# Altium schematic sheet ADC-ADC.SchDoc: <SPECIFIC SHEET FUNCTION>
size A3; Date: DO NOT USE, RATHER USE PROJ OPTIONS; DrawnBy: DO NOT USE, RATHER USE PROJ OPTIONS; Engineer: DO NOT USE, RATHER USE PROJ OPTIONS; Organization: DO NOT USE, RATHER USE PROJ OPTIONS; DocumentNumber: 10; Revision: DO NOT USE, RATHER USE PROJ OPTIONS; SheetNumber: 10; SheetTotal: 12; SCH_Sheet_Filename: ADC-ADC.SchDoc; CurrentTime: DO NOT USE, RATHER USE PROJ OPTIONS; Time: DO NOT USE, RATHER USE PROJ OPTIONS; DocumentFullPathAndName: DO NOT USE, RATHER USE PROJ OPTIONS; DocumentName: DO NOT USE, RATHER USE PROJ OPTIONS; ModifiedDate: DO NOT USE, RATHER USE PROJ OPTIONS; ImagePath: DO NOT USE, RATHER USE PROJ OPTIONS
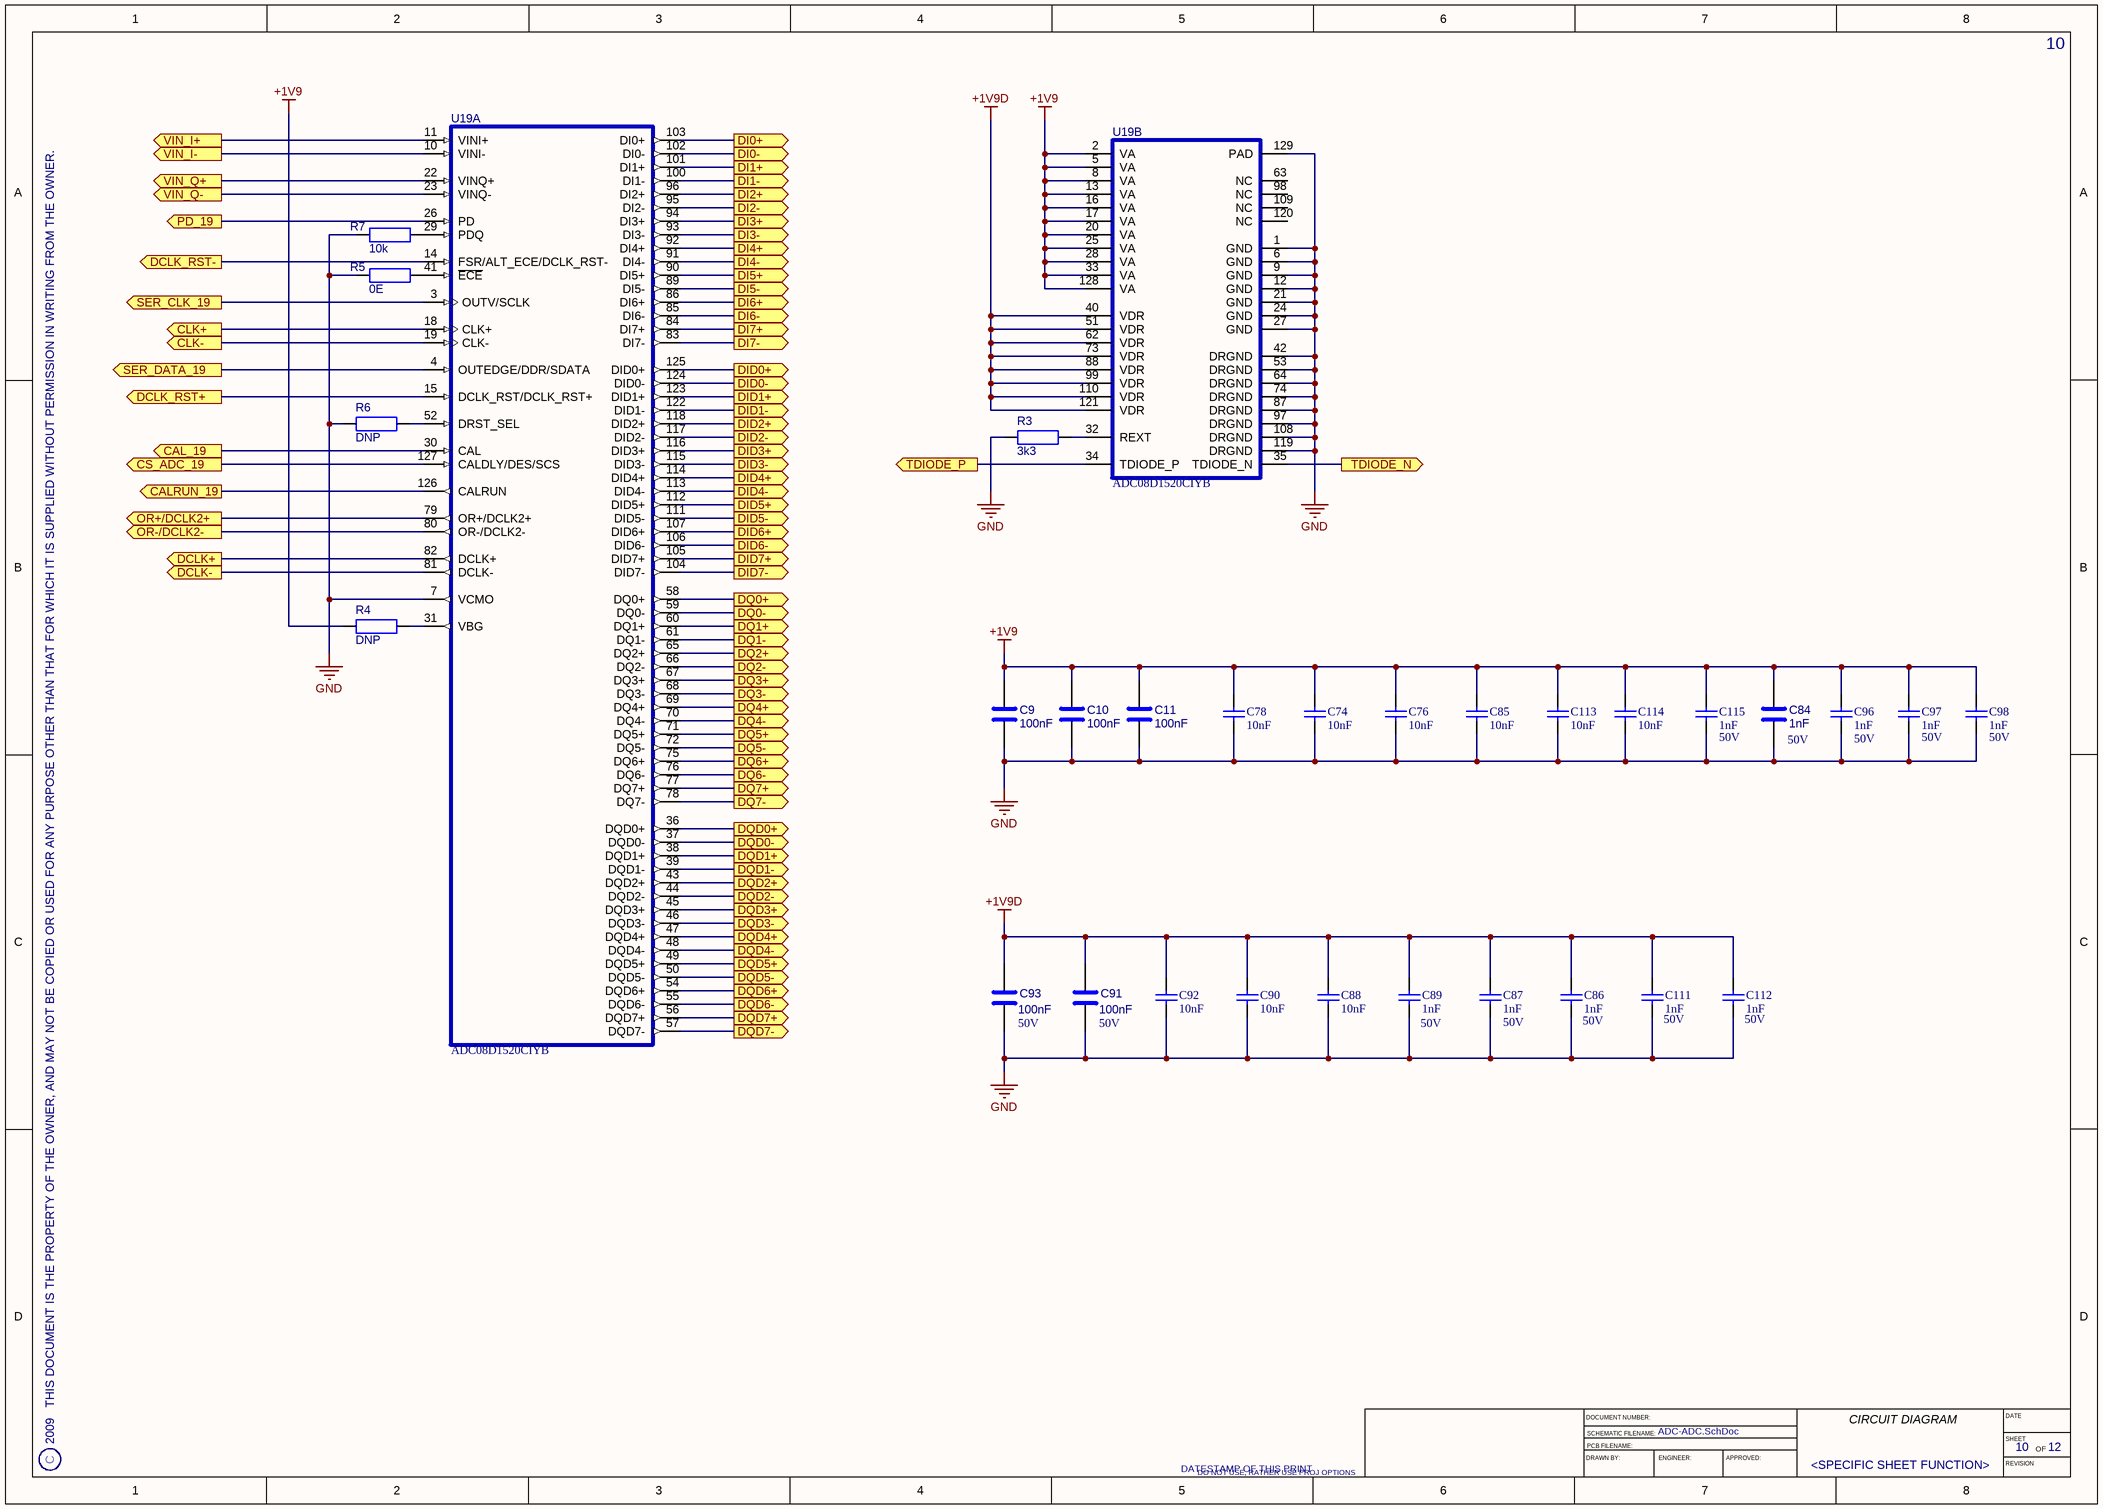
[diagram p0: ADC-ADC.SchDoc]

## Parts
C9  100nF  [0603]
C10  100nF  [0603]
C11  100nF  [0603]
C74  value 10nF  [CAPC1005X55N]  (hidden comment: Capacitor 0402 SMD)
C76  value 10nF  [CAPC1005X55N]  (hidden comment: Capacitor 0402 SMD)
C78  value 10nF  [CAPC1005X55N]  (hidden comment: Capacitor 0402 SMD)
C84  value 1nF  Voltage: 50V  [CAPC1005X55N]  (hidden comment: *)
C85  value 10nF  [CAPC1005X55N]  (hidden comment: Capacitor 0402 SMD)
C86  value 1nF  Voltage: 50V  [CAPC1005X55N]  (hidden comment: Capacitor 0402 SMD)
C87  value 1nF  Voltage: 50V  [CAPC1005X55N]  (hidden comment: Capacitor 0402 SMD)
C88  value 10nF  [CAPC1005X55N]  (hidden comment: Capacitor 0402 SMD)
C89  value 1nF  Voltage: 50V  [CAPC1005X55N]  (hidden comment: Capacitor 0402 SMD)
C90  value 10nF  [CAPC1005X55N]  (hidden comment: Capacitor 0402 SMD)
C91  value 100nF  Voltage: 50V  [0603]  (hidden comment: *)
C92  value 10nF  [CAPC1005X55N]  (hidden comment: Capacitor 0402 SMD)
C93  value 100nF  Voltage: 50V  [0603]  (hidden comment: *)
C96  value 1nF  Voltage: 50V  [CAPC1005X55N]  (hidden comment: Capacitor 0402 SMD)
C97  value 1nF  Voltage: 50V  [CAPC1005X55N]  (hidden comment: Capacitor 0402 SMD)
C98  value 1nF  Voltage: 50V  [CAPC1005X55N]  (hidden comment: Capacitor 0402 SMD)
C111  value 1nF  Voltage: 50V  [CAPC1005X55N]  (hidden comment: Capacitor 0402 SMD)
C112  value 1nF  Voltage: 50V  [CAPC1005X55N]  (hidden comment: Capacitor 0402 SMD)
C113  value 10nF  [CAPC1005X55N]  (hidden comment: Capacitor 0402 SMD)
C114  value 10nF  [CAPC1005X55N]  (hidden comment: Capacitor 0402 SMD)
C115  value 1nF  Voltage: 50V  [CAPC1005X55N]  (hidden comment: Capacitor 0402 SMD)
R3  3k3  [RESC1005X40N]
R4  DNP  [RESC1005X40N]
R5  0E  [RESC1005X40N]
R6  DNP  [RESC1005X40N]
R7  10k  [RESC1005X40N]
U19  ADC08D1520CIYB  [NS_VNX128A]  (parts A,B of 2)

## Ports
CAL_19 (out), CALRUN_19 (out), CLK+ (out), CLK- (out), CS_ADC_19 (out), DCLK+ (out), DCLK- (out), DCLK_RST+ (out), DCLK_RST- (out), DI0+ (out), DI0- (out), DI1+ (out), DI1- (out), DI2+ (out), DI2- (out), DI3+ (out), DI3- (out), DI4+ (out), DI4- (out), DI5+ (out), DI5- (out), DI6+ (out), DI6- (out), DI7+ (out), DI7- (out), DID0+ (out), DID0- (out), DID1+ (out), DID1- (out), DID2+ (out), DID2- (out), DID3+ (out), DID3- (out), DID4+ (out), DID4- (out), DID5+ (out), DID5- (out), DID6+ (out), DID6- (out), DID7+ (out), DID7- (out), DQ0+ (out), DQ0- (out), DQ1+ (out), DQ1- (out), DQ2+ (out), DQ2- (out), DQ3+ (out), DQ3- (out), DQ4+ (out), DQ4- (out), DQ5+ (out), DQ5- (out), DQ6+ (out), DQ6- (out), DQ7+ (out), DQ7- (out), DQD0+ (out), DQD0- (out), DQD1+ (out), DQD1- (out), DQD2+ (out), DQD2- (out), DQD3+ (out), DQD3- (out), DQD4+ (out), DQD4- (out), DQD5+ (out), DQD5- (out), DQD6+ (out), DQD6- (out), DQD7+ (out), DQD7- (out), OR+/DCLK2+ (out), OR-/DCLK2- (out), PD_19 (out), SER_CLK_19 (out), SER_DATA_19 (out), TDIODE_N (out), TDIODE_P (out), VIN_I+ (out), VIN_I- (out), VIN_Q+ (out), VIN_Q- (out)

## Nets
+1V9: C9.2 C10.2 C11.2 C74.1 C76.1 C78.1 C84.1 C85.1 C96.1 C97.1 C98.1 C113.1 C114.1 C115.1 R4.1 U19.2(VA) U19.5(VA) U19.8(VA) U19.13(VA) U19.16(VA) U19.17(VA) U19.20(VA) U19.25(VA) U19.28(VA) U19.33(VA) U19.128(VA)
+1V9D: C86.1 C87.1 C88.1 C89.1 C90.1 C91.1 C92.1 C93.1 C111.1 C112.1 U19.40(VDR) U19.51(VDR) U19.62(VDR) U19.73(VDR) U19.88(VDR) U19.99(VDR) U19.110(VDR) U19.121(VDR)
GND: C9.1 C10.1 C11.1 C74.2 C76.2 C78.2 C84.2 C85.2 C86.2 C87.2 C88.2 C89.2 C90.2 C91.2 C92.2 C93.2 C96.2 C97.2 C98.2 C111.2 C112.2 C113.2 C114.2 C115.2 R3.1 R5.1 R6.1 R7.1 U19.1(GND) U19.6(GND) U19.7(VCMO) U19.9(GND) U19.12(GND) U19.21(GND) U19.24(GND) U19.27(GND) U19.42(DRGND) U19.53(DRGND) U19.64(DRGND) U19.74(DRGND) U19.87(DRGND) U19.97(DRGND) U19.108(DRGND) U19.119(DRGND) U19.129(PAD)
CAL_19: U19.30(CAL) ; port CAL_19
CALRUN_19: U19.126(CALRUN) ; port CALRUN_19
CLK+: U19.18(CLK+) ; port CLK+
CLK-: U19.19(CLK-) ; port CLK-
CS_ADC_19: U19.127(CALDLY/DES/SCS) ; port CS_ADC_19
DCLK+: U19.82(DCLK+) ; port DCLK+
DCLK-: U19.81(DCLK-) ; port DCLK-
DCLK_RST+: U19.15(DCLK_RST/DCLK_RST+) ; port DCLK_RST+
DCLK_RST-: U19.14(FSR/ALT_ECE/DCLK_RST-) ; port DCLK_RST-
DI0+: U19.103(DI0+) ; port DI0+
DI0-: U19.102(DI0-) ; port DI0-
DI1+: U19.101(DI1+) ; port DI1+
DI1-: U19.100(DI1-) ; port DI1-
DI2+: U19.96(DI2+) ; port DI2+
DI2-: U19.95(DI2-) ; port DI2-
DI3+: U19.94(DI3+) ; port DI3+
DI3-: U19.93(DI3-) ; port DI3-
DI4+: U19.92(DI4+) ; port DI4+
DI4-: U19.91(DI4-) ; port DI4-
DI5+: U19.90(DI5+) ; port DI5+
DI5-: U19.89(DI5-) ; port DI5-
DI6+: U19.86(DI6+) ; port DI6+
DI6-: U19.85(DI6-) ; port DI6-
DI7+: U19.84(DI7+) ; port DI7+
DI7-: U19.83(DI7-) ; port DI7-
DID0+: U19.125(DID0+) ; port DID0+
DID0-: U19.124(DID0-) ; port DID0-
DID1+: U19.123(DID1+) ; port DID1+
DID1-: U19.122(DID1-) ; port DID1-
DID2+: U19.118(DID2+) ; port DID2+
DID2-: U19.117(DID2-) ; port DID2-
DID3+: U19.116(DID3+) ; port DID3+
DID3-: U19.115(DID3-) ; port DID3-
DID4+: U19.114(DID4+) ; port DID4+
DID4-: U19.113(DID4-) ; port DID4-
DID5+: U19.112(DID5+) ; port DID5+
DID5-: U19.111(DID5-) ; port DID5-
DID6+: U19.107(DID6+) ; port DID6+
DID6-: U19.106(DID6-) ; port DID6-
DID7+: U19.105(DID7+) ; port DID7+
DID7-: U19.104(DID7-) ; port DID7-
DQ0+: U19.58(DQ0+) ; port DQ0+
DQ0-: U19.59(DQ0-) ; port DQ0-
DQ1+: U19.60(DQ1+) ; port DQ1+
DQ1-: U19.61(DQ1-) ; port DQ1-
DQ2+: U19.65(DQ2+) ; port DQ2+
DQ2-: U19.66(DQ2-) ; port DQ2-
DQ3+: U19.67(DQ3+) ; port DQ3+
DQ3-: U19.68(DQ3-) ; port DQ3-
DQ4+: U19.69(DQ4+) ; port DQ4+
DQ4-: U19.70(DQ4-) ; port DQ4-
DQ5+: U19.71(DQ5+) ; port DQ5+
DQ5-: U19.72(DQ5-) ; port DQ5-
DQ6+: U19.75(DQ6+) ; port DQ6+
DQ6-: U19.76(DQ6-) ; port DQ6-
DQ7+: U19.77(DQ7+) ; port DQ7+
DQ7-: U19.78(DQ7-) ; port DQ7-
DQD0+: U19.36(DQD0+) ; port DQD0+
DQD0-: U19.37(DQD0-) ; port DQD0-
DQD1+: U19.38(DQD1+) ; port DQD1+
DQD1-: U19.39(DQD1-) ; port DQD1-
DQD2+: U19.43(DQD2+) ; port DQD2+
DQD2-: U19.44(DQD2-) ; port DQD2-
DQD3+: U19.45(DQD3+) ; port DQD3+
DQD3-: U19.46(DQD3-) ; port DQD3-
DQD4+: U19.47(DQD4+) ; port DQD4+
DQD4-: U19.48(DQD4-) ; port DQD4-
DQD5+: U19.49(DQD5+) ; port DQD5+
DQD5-: U19.50(DQD5-) ; port DQD5-
DQD6+: U19.54(DQD6+) ; port DQD6+
DQD6-: U19.55(DQD6-) ; port DQD6-
DQD7+: U19.56(DQD7+) ; port DQD7+
DQD7-: U19.57(DQD7-) ; port DQD7-
OR+/DCLK2+: U19.79(OR+/DCLK2+) ; port OR+/DCLK2+
OR-/DCLK2-: U19.80(OR-/DCLK2-) ; port OR-/DCLK2-
PD_19: U19.26(PD) ; port PD_19
SER_CLK_19: U19.3(OUTV/SCLK) ; port SER_CLK_19
SER_DATA_19: U19.4(OUTEDGE/DDR/SDATA) ; port SER_DATA_19
TDIODE_N: U19.35(TDIODE_N) ; port TDIODE_N
TDIODE_P: U19.34(TDIODE_P) ; port TDIODE_P
VIN_I+: U19.11(VINI+) ; port VIN_I+
VIN_I-: U19.10(VINI-) ; port VIN_I-
VIN_Q+: U19.22(VINQ+) ; port VIN_Q+
VIN_Q-: U19.23(VINQ-) ; port VIN_Q-
NetR3_2: R3.2 U19.32(REXT)
NetR4_2: R4.2 U19.31(VBG)
NetR5_2: R5.2 U19.41(~{ECE})
NetR6_2: R6.2 U19.52(DRST_SEL)
NetR7_2: R7.2 U19.29(PDQ)

Not connected (* = marked no-connect by the designer): U19 63(NC) 98(NC) 109(NC) 120(NC)

## Notes on the sheet
- 2009   THIS DOCUMENT IS THE PROPERTY OF THE OWNER, AND MAY NOT BE COPIED OR USED FOR ANY PURPOSE OTHER THAN THAT FOR WHICH IT IS SUPPLIED WITHOUT PERMISSION IN WRITING FROM THE OWNER.
- C
- DATESTAMP OF THIS PRINT
- DRAWN BY:
- DOCUMENT NUMBER:
- SCHEMATIC FILENAME:
- PCB FILENAME:
- ENGINEER:
- APPROVED:
- CIRCUIT DIAGRAM
- DATE
- SHEET
- REVISION
- OF

## Library data of the parts
C9-C11 C84 C91 C93 = CAP-0603: CAP SMD 0603; Manufacturer: *; Manufacturer_PN: *; Created_By: *; Checked_By: *; Checked_Date: *; HelpURL: *; ComponentLink1Description: Footprint Detail; ComponentLink1URL: *; ComponentLink2Description: Application Note; ComponentLink2URL: *; ComponentLink3Description: Layout Guidelines; ComponentLink3URL: *; ComponentLink4Description: Technology Reference; ComponentLink4URL: *; Supplier1: *; Supplier2: *; Unit_Cost: *; MOQ: *; Leadtime: *; Inventory_Stock: *; Tolerance: *; Wattage: *; Package: 0603; ComponentLink5Description: Production Detail; ComponentLink5URL: *; Note: *; Stock Code: *
  C9-C11: Voltage: *; Value: 100nF
C74 C76 C78 C85-C90 C92 C96-C98 C111-C115 = cap0402: Created_By: EDA-ASA; Checked_By: *; Checked_Date: *; HelpURL: *; Supplier1: *; Supplier2: *; Unit_Cost: *; MOQ: *; Leadtime: *; Inventory_Stock: *; Tolerance: *; Wattage: *; Package: 0402; ComponentLinked1Description: *; ComponentLinked1URL: *; ComponentLinked2Description: *; ComponentLinked2URL: *; ComponentLinked3Description: *; ComponentLinked3URL: *; ComponentLinked4Description: *; ComponentLinked4URL: *
R3-R7 = RES-0805: RESISTOR SMD 0805; Checked_By: NN; Manufacturer: *; Manufacturer_PN: *; Created_By: *; Checked_Date: 5-08-2009; HelpURL: *; ComponentLink1Description: Footprint Detail; ComponentLink1URL: *; ComponentLink2Description: Application Note; ComponentLink2URL: *; ComponentLink3Description: Layout Guidelines; ComponentLink3URL: *; ComponentLink4Description: Technology Reference; ComponentLink4URL: *; Supplier1: *; Supplier2: *; Unit_Cost: *; MOQ: *; Leadtime: *; Inventory_Stock: *; Tolerance: *; Wattage: *; Voltage: *; Package: 0805; ComponentLink5Description: Production Detail; ComponentLink5URL: *; Note: *; Stock Code: *
  R3: Value: 3k3
  R4 R6: Value: DNP
  R5: Value: 0E
  R7: Value: 10k
U19 = ADC08D1520CIYB: Low Power, 8-Bit, Dual 1.5 GSPS or Single 3.0 GSPS A/D Converter; Manufacturer: National Semiconductor; Created_By: IN; Manufacturer_PN: ADC08D1520CIYB; Checked_By: *; Checked_Date: *; HelpURL: X:\Datasheets\By_Manufacturer\National Semi\ADC08D1520.pdf; ComponentLink1Description: X:\Datasheets\By_Manufacturer\National Semi\ADC08D1520.pdf#page=4; ComponentLink1URL: *; ComponentLink2Description: Application Note; ComponentLink2URL: *; ComponentLink3Description: Layout Guidelines; ComponentLink3URL: *; ComponentLink4Description: Technology Reference; ComponentLink4URL: *; Supplier1: *; Supplier2: *; Unit_Cost: *; MOQ: *; Leadtime: *; Inventory_Stock: *; Tolerance: *; Wattage: *; Voltage: *; Package: *; ComponentLink5Description: Production Detail; ComponentLink5URL: *; Note: *; Stock Code: *